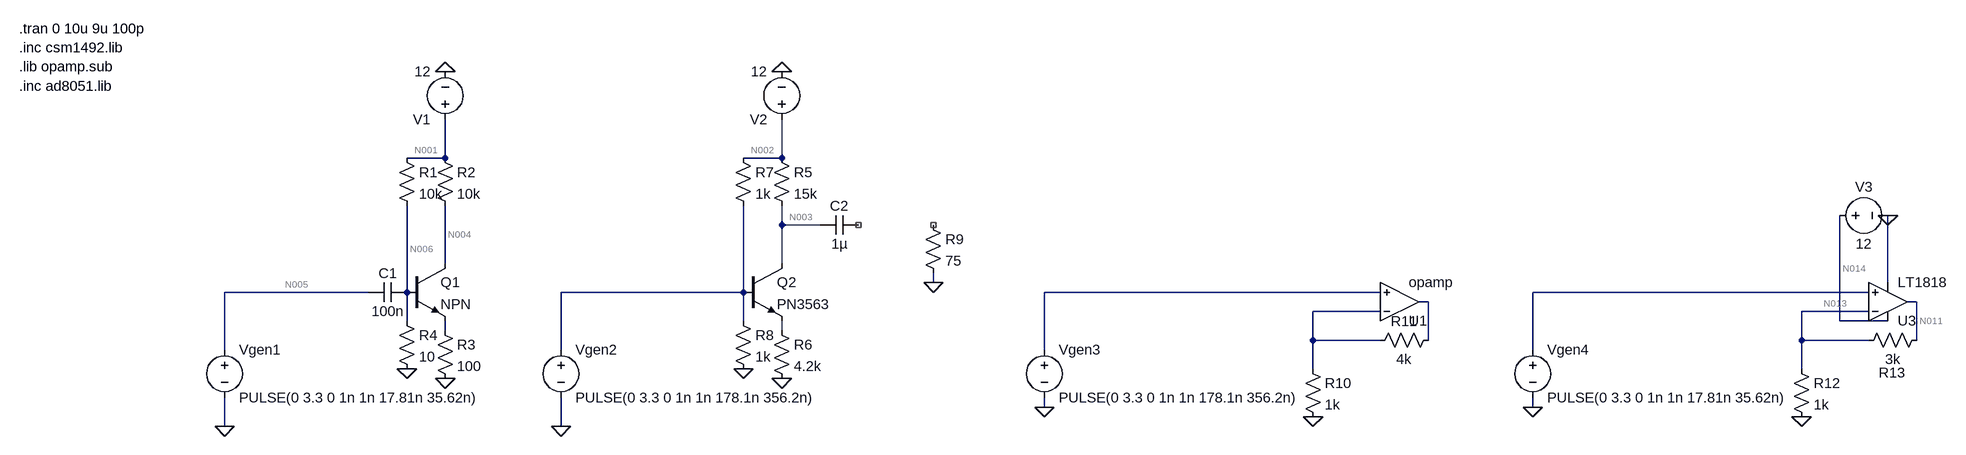
[diagram p0: schematic first_stage_10_meter_before_class_e.asc]
first_stage_10_meter_before_class_e.asc, the LTspice schematic file:
Version 4
SHEET 1 3232 680
WIRE 240 -96 240 -160
WIRE 240 -96 176 -96
WIRE 1136 -96 1136 -160
WIRE 1136 -96 1072 -96
WIRE 1136 16 1136 -16
WIRE 1200 16 1136 16
WIRE 240 80 240 -16
WIRE 1136 80 1136 16
WIRE 1392 112 1392 96
WIRE 3120 112 3120 0
WIRE 112 128 -128 128
WIRE 176 128 176 -16
WIRE 1072 128 1072 -16
WIRE 1072 128 768 128
WIRE 2272 128 1712 128
WIRE 3088 128 2528 128
WIRE 2352 144 2336 144
WIRE 3168 144 3152 144
WIRE 2272 160 2160 160
WIRE 3088 160 2976 160
WIRE 176 176 176 128
WIRE 1072 176 1072 128
WIRE 3040 176 3040 0
WIRE 3120 176 3040 176
WIRE 240 192 240 176
WIRE 1136 192 1136 176
WIRE 2160 208 2160 160
WIRE 2272 208 2160 208
WIRE 2352 208 2352 144
WIRE 2976 208 2976 160
WIRE 3088 208 2976 208
WIRE 3168 208 3168 144
WIRE -128 224 -128 128
WIRE 768 224 768 128
WIRE 1712 224 1712 128
WIRE 2528 224 2528 128
WIRE 2160 256 2160 208
WIRE 2976 256 2976 208
WIRE 1712 320 1712 304
WIRE 2528 320 2528 304
WIRE -128 352 -128 304
WIRE 768 352 768 304
FLAG -128 352 0
FLAG 240 272 0
FLAG 240 -240 0
FLAG 176 256 0
FLAG 768 352 0
FLAG 1136 272 0
FLAG 1136 -240 0
FLAG 1072 256 0
FLAG 1392 112 0
FLAG 1712 320 0
FLAG 2160 336 0
FLAG 2528 320 0
FLAG 2976 336 0
FLAG 3120 0 0
SYMBOL voltage -128 208 R0
WINDOW 123 24 132 Left 0
WINDOW 39 24 124 Left 2
SYMATTR InstName Vgen1
SYMATTR Value PULSE(0 3.3 0 1n 1n 17.81n 35.62n)
SYMBOL res 224 -112 R0
SYMATTR InstName R2
SYMATTR Value 10k
SYMBOL voltage 240 -144 R180
WINDOW 123 0 0 Left 0
WINDOW 39 0 0 Left 0
SYMATTR InstName V1
SYMATTR Value 12
SYMBOL npn 176 80 R0
SYMATTR InstName Q1
SYMBOL res 224 176 R0
SYMATTR InstName R3
SYMATTR Value 100
SYMBOL cap 176 112 R90
WINDOW 0 0 32 VBottom 2
WINDOW 3 32 32 VTop 2
SYMATTR InstName C1
SYMATTR Value 100n
SYMBOL res 160 -112 R0
SYMATTR InstName R1
SYMATTR Value 10k
SYMBOL res 160 160 R0
SYMATTR InstName R4
SYMATTR Value 10
SYMBOL voltage 768 208 R0
WINDOW 123 24 132 Left 0
WINDOW 39 24 124 Left 2
SYMATTR InstName Vgen2
SYMATTR Value PULSE(0 3.3 0 1n 1n 178.1n 356.2n)
SYMBOL res 1120 -112 R0
SYMATTR InstName R5
SYMATTR Value 15k
SYMBOL voltage 1136 -144 R180
WINDOW 123 0 0 Left 0
WINDOW 39 0 0 Left 0
SYMATTR InstName V2
SYMATTR Value 12
SYMBOL npn 1072 80 R0
SYMATTR InstName Q2
SYMATTR Value PN3563
SYMBOL res 1120 176 R0
SYMATTR InstName R6
SYMATTR Value 4.2k
SYMBOL res 1056 -112 R0
SYMATTR InstName R7
SYMATTR Value 1k
SYMBOL res 1056 160 R0
SYMATTR InstName R8
SYMATTR Value 1k
SYMBOL res 1376 0 R0
SYMATTR InstName R9
SYMATTR Value 75
SYMBOL cap 1264 0 R90
WINDOW 0 0 32 VBottom 2
WINDOW 3 32 32 VTop 2
SYMATTR InstName C2
SYMATTR Value 1µ
SYMBOL voltage 1712 208 R0
WINDOW 123 24 132 Left 0
WINDOW 39 24 124 Left 2
SYMATTR InstName Vgen3
SYMATTR Value PULSE(0 3.3 0 1n 1n 178.1n 356.2n)
SYMBOL OpAmps\\opamp 2304 208 M180
SYMATTR InstName U1
SYMBOL res 2144 240 R0
SYMATTR InstName R10
SYMATTR Value 1k
SYMBOL res 2368 192 R90
WINDOW 0 0 56 VBottom 2
WINDOW 3 32 56 VTop 2
SYMATTR InstName R11
SYMATTR Value 4k
SYMBOL voltage 2528 208 R0
WINDOW 123 24 132 Left 0
WINDOW 39 24 124 Left 2
SYMATTR InstName Vgen4
SYMATTR Value PULSE(0 3.3 0 1n 1n 17.81n 35.62n)
SYMBOL res 2960 240 R0
SYMATTR InstName R12
SYMATTR Value 1k
SYMBOL res 3184 192 R90
WINDOW 0 86 57 VBottom 2
WINDOW 3 32 56 VTop 2
SYMATTR InstName R13
SYMATTR Value 3k
SYMBOL voltage 3024 0 R270
WINDOW 0 32 56 VTop 2
WINDOW 3 -32 56 VBottom 2
SYMATTR InstName V3
SYMATTR Value 12
SYMBOL OpAmps\\LT1818 3120 144 M180
SYMATTR InstName U3
TEXT -792 -312 Left 2 !.tran 0 10u 9u 100p
TEXT -792 -280 Left 2 !.inc csm1492.lib
TEXT -792 -248 Left 2 !.lib opamp.sub
TEXT -792 -216 Left 2 !.inc ad8051.lib

The netlist it stands for:
* first_stage_10_meter_before_class_e.asc
Vgen1 N005 0 PULSE(0 3.3 0 1n 1n 17.81n 35.62n)
R2 N001 N004 10k
V1 N001 0 12
Q1 N004 N006 N015 0 NPN
R3 N015 0 100
C1 N006 N005 100n
R1 N001 N006 10k
R4 N006 0 10
Vgen2 N007 0 PULSE(0 3.3 0 1n 1n 178.1n 356.2n)
R5 N002 N003 15k
V2 N002 0 12
Q2 N003 N007 N016 0 PN3563
R6 N016 0 4.2k
R7 N002 N007 1k
R8 N007 0 1k
R9 NC_01 0 75
C2 NC_02 N003 1µ
Vgen3 N008 0 PULSE(0 3.3 0 1n 1n 178.1n 356.2n)
XU1 N012 N008 N010 opamp Aol=100K GBW=10Meg  ; pins invin noninvin out
R10 N012 0 1k
R11 N010 N012 4k
Vgen4 N009 0 PULSE(0 3.3 0 1n 1n 17.81n 35.62n)
R12 N013 0 1k
R13 N011 N013 3k
V3 N014 0 12
XU3 N009 N013 N011 N014 0 LT1818  ; pins In+ In- OUT V+ V-
.model NPN NPN
.model PNP PNP
.lib standard.bjt
.tran 0 10u 9u 100p
.inc csm1492.lib
.lib opamp.sub
.inc ad8051.lib
.lib LTC2.lib
.backanno
.end

* Results of the author's LTspice run, read from the files saved beside the schematic
* Operating Point, zero values left out:
*   V(n001) = 12 V
*   V(n004) = 12 V
*   V(n006) = 11.99 mV
*   V(n002) = 12 V
*   V(n003) = 12 V
*   V(n013) = 574.6 mV
*   V(n011) = 2.293 V
*   V(n014) = 12 V
*   Ic(Q1) = 11.99 pA
*   Ib(Q1) = -11.98 pA
*   Ic(Q2) = 12 pA
*   Ib(Q2) = -12 pA
*   I(R2) = 11.99 pA
*   I(R1) = 1.199 mA
*   I(R4) = 1.199 mA
*   I(R5) = 12 pA
*   I(R7) = 12 mA
*   I(R12) = 574.6 µA
*   I(R13) = 572.8 µA
*   I(V1) = -1.199 mA
*   I(Vgen2) = 12 mA
*   I(V2) = -12 mA
*   I(Vgen4) = 3.466 µA
*   I(V3) = -9.519 mA
*   Ix(u3:1) = -3.466 µA
*   Ix(u3:2) = -1.876 µA
*   Ix(u3:3) = -572.8 µA
*   Ix(u3:4) = 9.519 mA
*   Ix(u3:5) = -8.941 mA
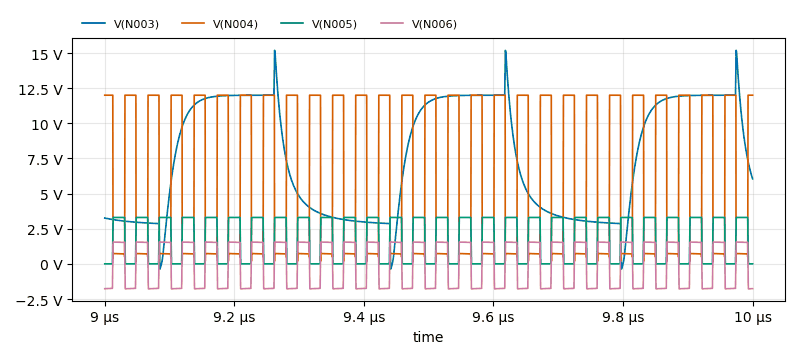
[diagram p1: Transient Analysis of first_stage_10_meter_before_class_e.asc, plotted from the saved traces]
* Transient Analysis, 1 run:
*   V(N003): min -374.4 mV, max 15.19 V, average 7.623 V, rms 8.677 V, last 6.053 V
*   V(N004): min 194 mV, max 12 V, average 6.222 V, rms 8.386 V, last 12 V
*   V(N005): min 0 V, max 3.3 V, average 1.738 V, rms 2.374 V, last 0 V
*   V(N006): min -1.774 V, max 1.554 V, average -22.18 mV, rms 1.617 V, last -1.763 V